# Altium schematic sheet PCIe.SchDoc
size A3
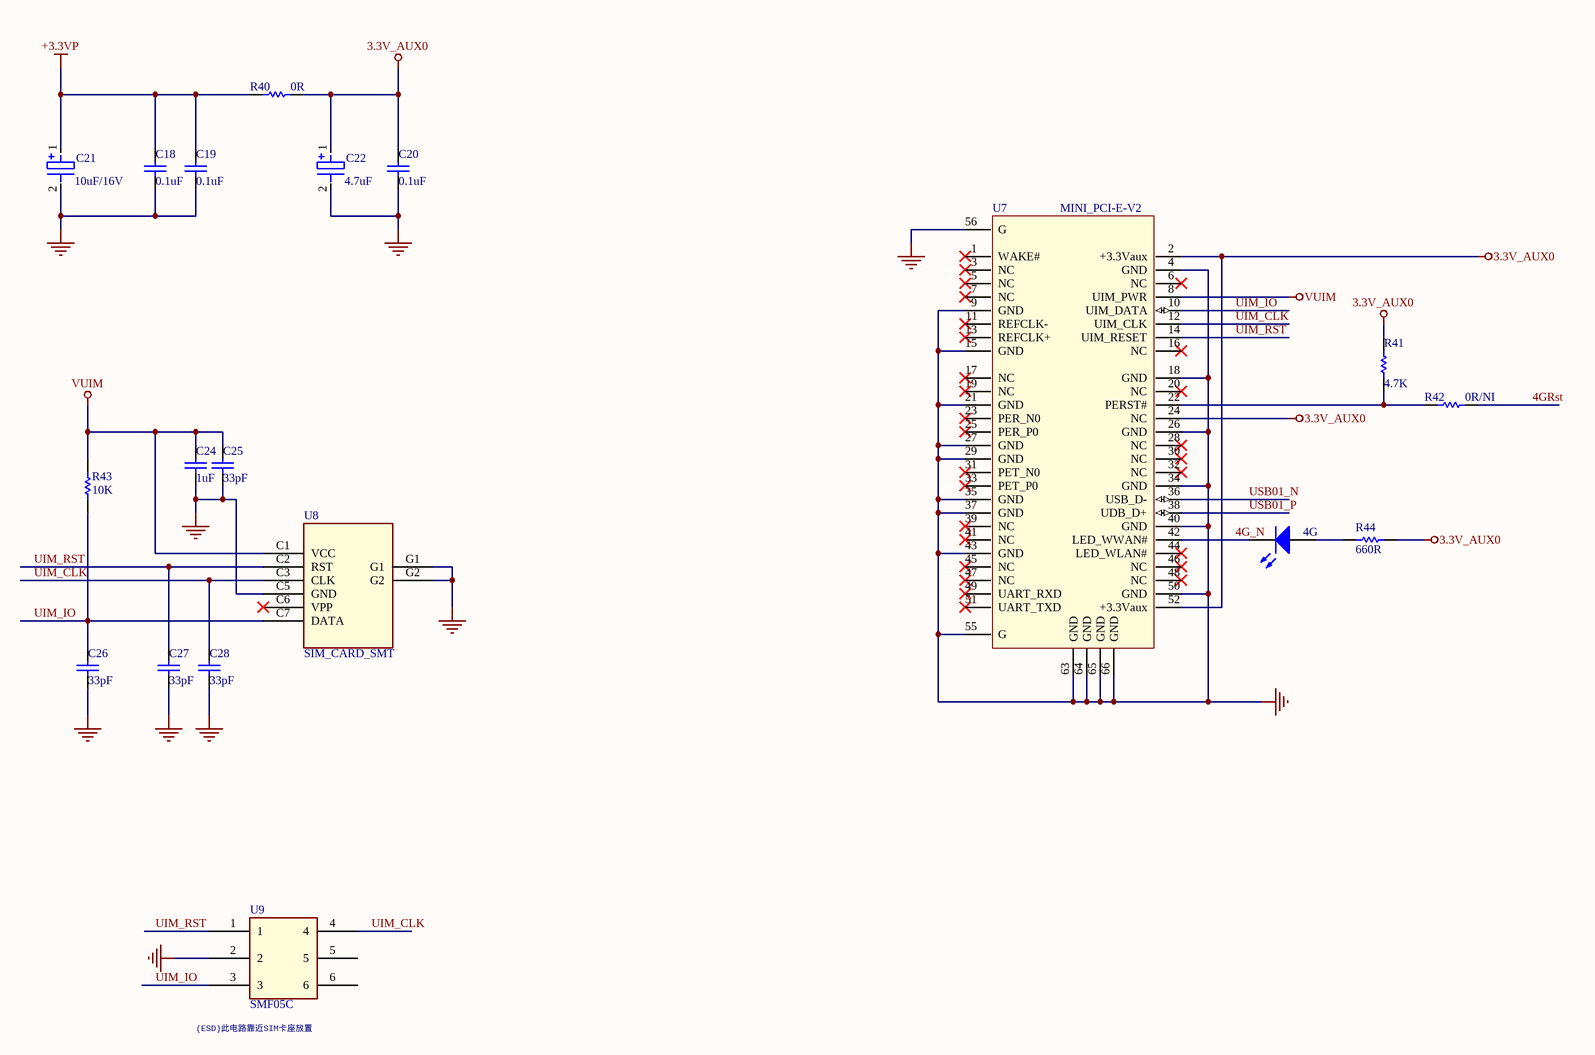
[diagram p0: PCIe.SchDoc]

## Parts
4G  leds_0603  [0603LED]  (value not drawn)
C18  value 0.1uF  [C0603L]  (hidden comment: Cap Semi)
C19  value 0.1uF  [C0603L]  (hidden comment: Cap Semi)
C20  value 0.1uF  [C0603L]  (hidden comment: Cap Semi)
C21  value 10uF/16V  [C0603L]  (hidden comment: Cap Semi)
C22  value 4.7uF  [C0603L]  (hidden comment: Cap Semi)
C24  value 1uF  [C0603L]  (hidden comment: Cap Semi)
C25  value 33pF  [C0603L]  (hidden comment: Cap Semi)
C26  value 33pF  [C0603L]  (hidden comment: Cap Semi)
C27  value 33pF  [C0603L]  (hidden comment: Cap Semi)
C28  value 33pF  [C0603L]  (hidden comment: Cap Semi)
R40  value 0R  [R0603L]  (hidden comment: Res Semi)
R41  value 4.7K  [R0603L]  (hidden comment: Res Semi)
R42  value 0R/NI  [R0603L]  (hidden comment: Res Semi)
R43  value 10K  [R0603L]  (hidden comment: Res Semi)
R44  value 660R  [R0603L]  (hidden comment: Res Semi)
U7  MINI_PCI-E-V2  [MINI_PCI-E_V2]
U8  SIM_CARD_SMT  [SIM_CARD_SMT]
U9  SMF05C  [SMF05C]

## Nets
3.3V_AUX0: C20.2 C22.1 R40.1 R41.1 R44.2 U7.2(+3.3Vaux) U7.24(NC) U7.52(+3.3Vaux)
+3.3VP: C18.2 C19.2 C21.1 R40.2
GND: C18.1 C19.1 C20.1 C21.2 C22.2 C24.2 C25.2 C26.2 C27.2 C28.2 U7.4(GND) U7.9(GND) U7.15(GND) U7.18(GND) U7.21(GND) U7.26(GND) U7.27(GND) U7.29(GND) U7.34(GND) U7.35(GND) U7.37(GND) U7.40(GND) U7.43(GND) U7.50(GND) U7.55(G) U7.56(G) U7.63(GND) U7.64(GND) U7.65(GND) U7.66(GND) U8.C5(GND) U8.G1 U8.G2 U9.2
VUIM: C24.1 C25.1 R43.2 U7.8(UIM_PWR) U8.C1(VCC)
4G_N: 4G.2(K) U7.42(LED_WWAN#)
4GRst: R42.2
UIM_CLK: C28.1 U7.12(UIM_CLK) U8.C3(CLK) U9.4
UIM_IO: C26.1 R43.1 U7.10(UIM_DATA) U8.C7(DATA) U9.3
UIM_RST: C27.1 U7.14(UIM_RESET) U8.C2(RST) U9.1
USB01_N: U7.36(USB_D-)
USB01_P: U7.38(UDB_D+)
Net4G_1: 4G.1(A) R44.1
NetR41_2: R41.2 R42.1 U7.22(PERST#)

Not connected (* = marked no-connect by the designer): U7 1(WAKE#)* 3(NC)* 5(NC)* 6(NC)* 7(NC)* 11(REFCLK-)* 13(REFCLK+)* 16(NC)* 17(NC)* 19(NC)* 20(NC)* 23(PER_N0)* 25(PER_P0)* 28(NC)* 30(NC)* 31(PET_N0)* 32(NC)* 33(PET_P0)* 39(NC)* 41(NC)* 44(LED_WLAN#)* 45(NC)* 46(NC)* 47(NC)* 48(NC)* 49(UART_RXD)* 51(UART_TXD)*; U8 C6(VPP)*; U9 5 6

## Notes on the sheet
- (near U9) (ESD)此电路靠近SIM卡座放置

## Library data of the parts
C18-C20 = Cap: Capacitor; Published: 8-Jun-2000; LatestRevisionDate: 17-Jul-2002; LatestRevisionNote: Re-released for DXP Platform.; PackageReference: RAD-0.3; Publisher: Altium Limited
C21 C22 = CAP3
C24-C28 = Cap Semi: Capacitor (Semiconductor SIM Model); Published: 8-Jun-2000; LatestRevisionDate: 17-Jul-2002; LatestRevisionNote: Re-released for DXP Platform.; PackageReference: C1206; Publisher: Altium Limited
R40-R44 = Res Semi: Semiconductor Resistor; Published: 8-Jun-2000; LatestRevisionDate: 17-Jul-2002; LatestRevisionNote: Re-released for DXP Platform.; PackageReference: AXIAL-0.5; Publisher: Altium Limited